# EasyEDA Pro project haptic_knob.eprj, schematic Schematic2_3
Board Name: Final; Create Date: 2025-07-09; Page Name: mcu; Project Name: haptic_knob; Schematic Name: Schematic2_3; Update Date: 2026-03-03; Company: EasyEDA.com; Page Size: A4; Version: V1.0
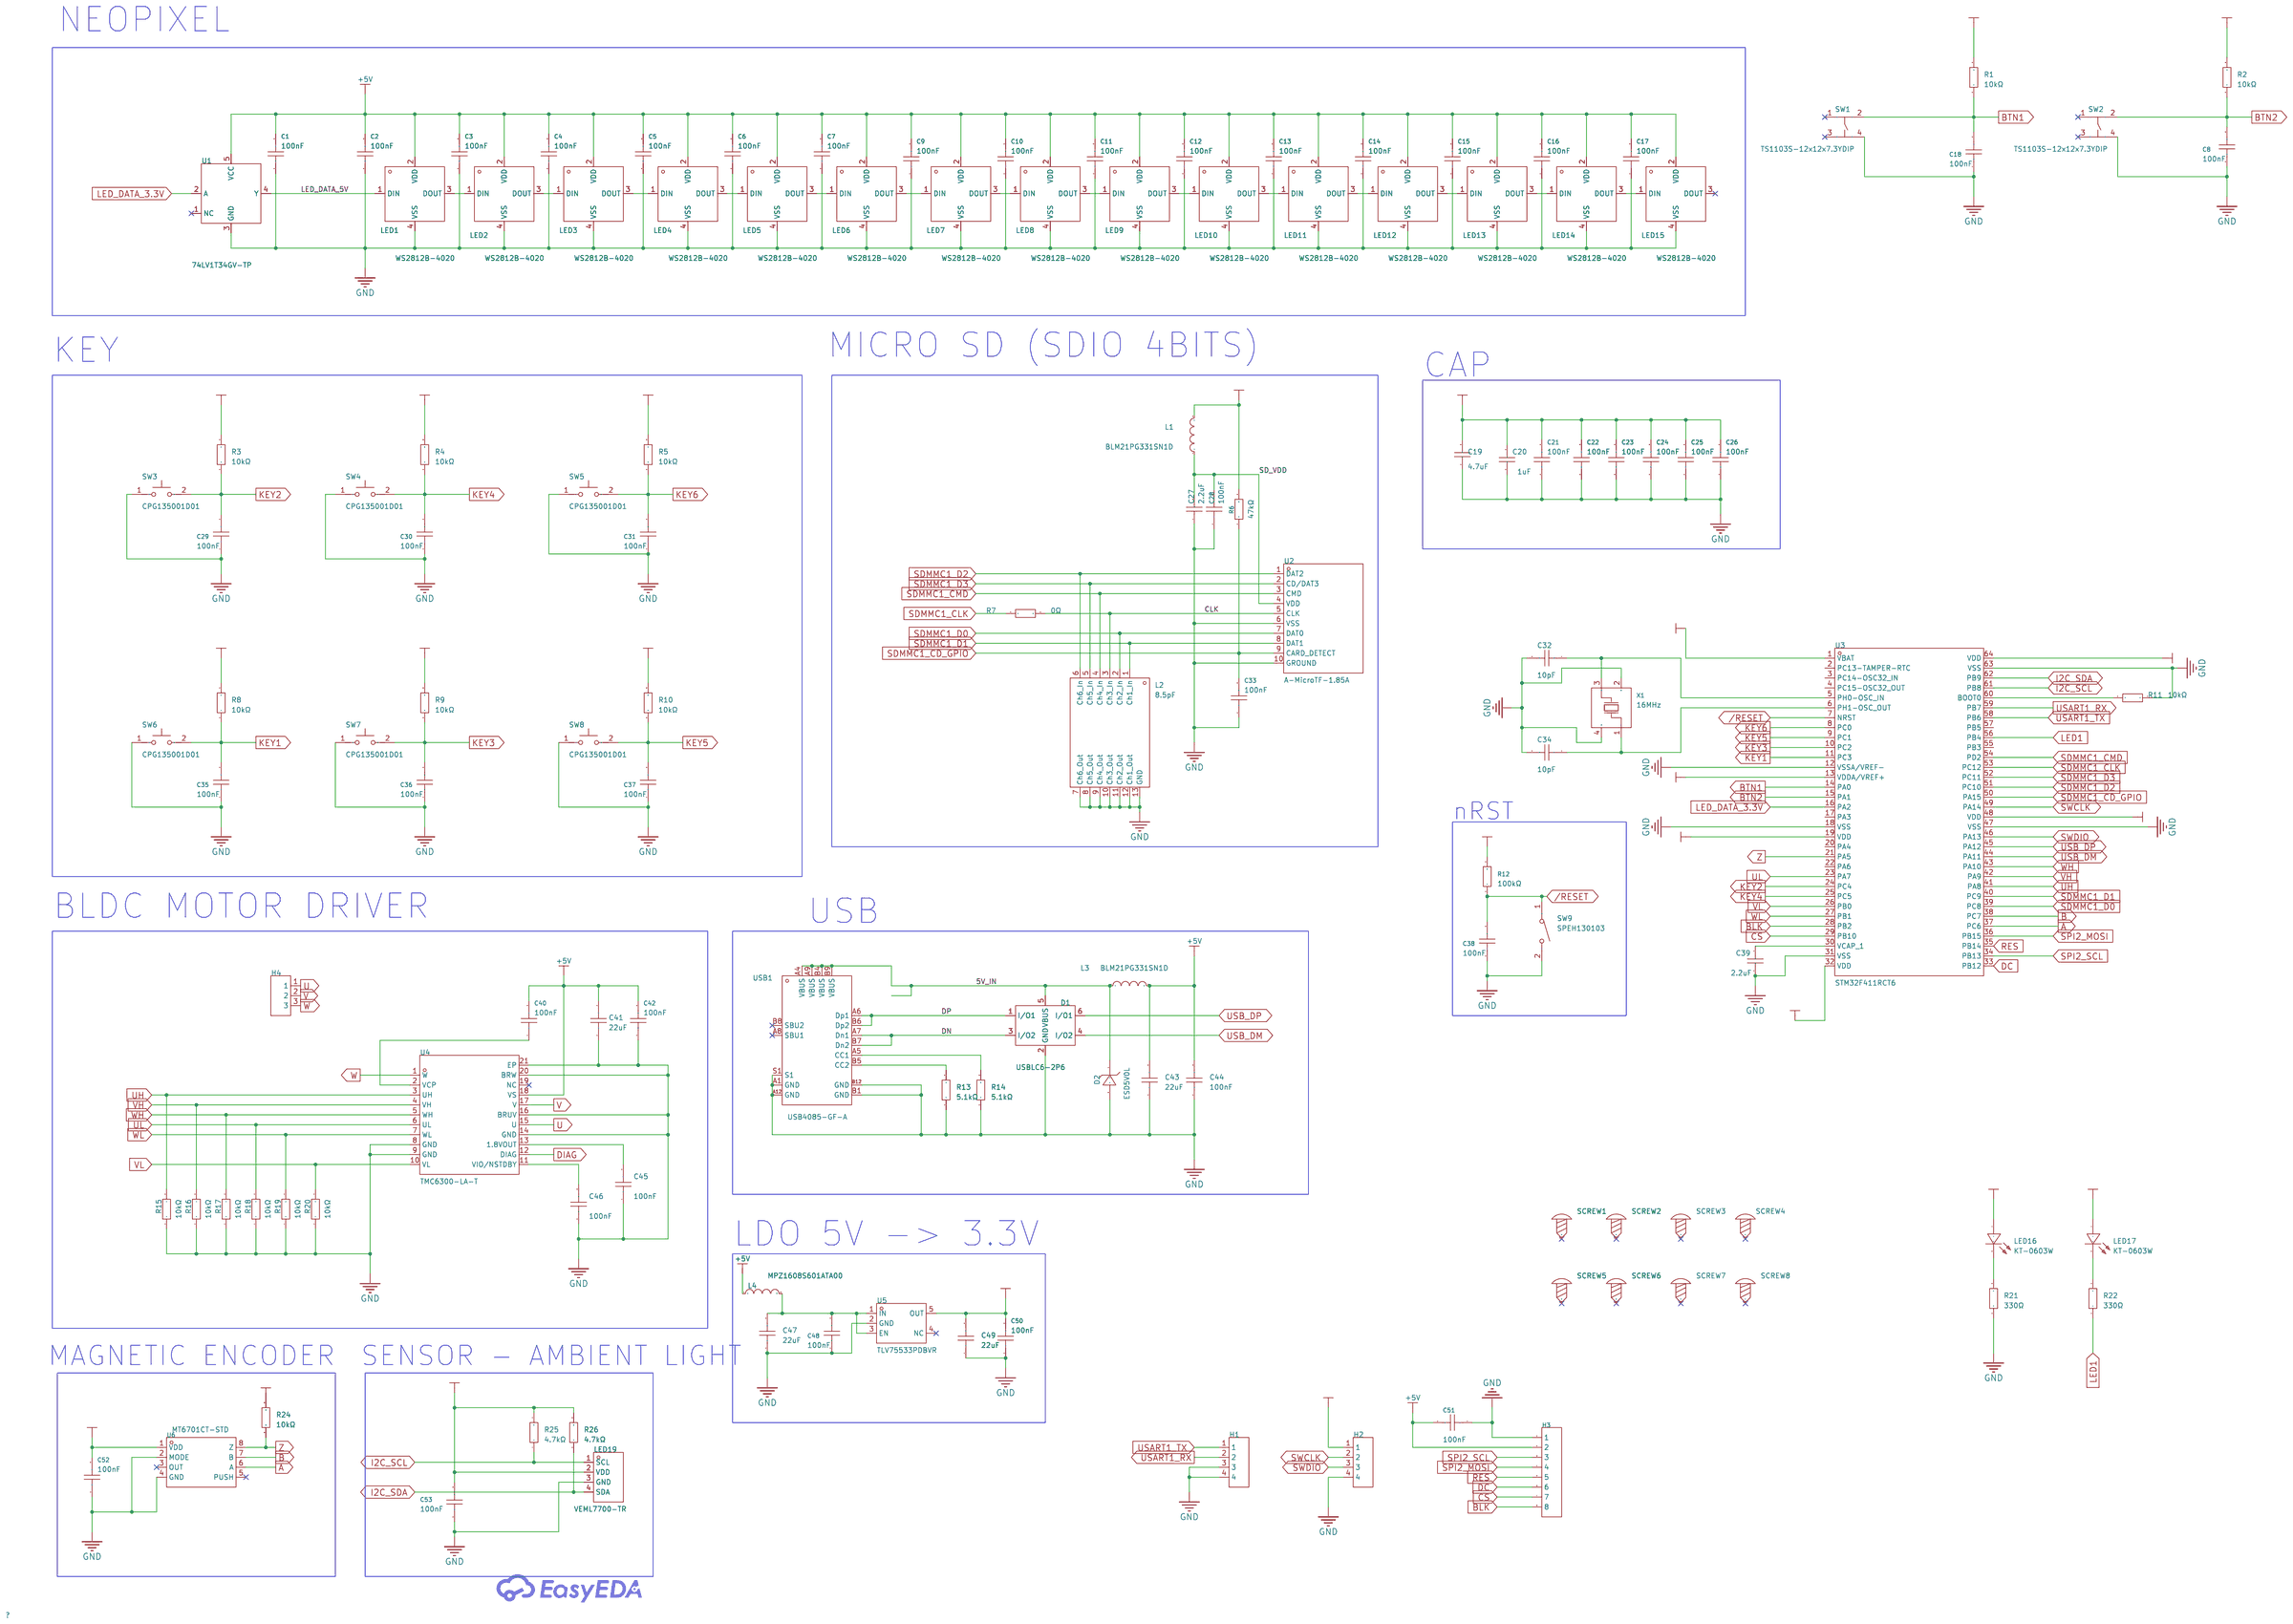
[diagram p0: schematic sheet]

## Parts
C1  100nF  [C0603]
C2  100nF  [C0603]
C3  100nF  [C0603]
C4  100nF  [C0603]
C5  100nF  [C0603]
C6  100nF  [C0603]
C7  100nF  [C0603]
C8  100nF  [C0603]
C9  100nF  [C0603]
C10  100nF  [C0603]
C11  100nF  [C0603]
C12  100nF  [C0603]
C13  100nF  [C0603]
C14  100nF  [C0603]
C15  100nF  [C0603]
C16  100nF  [C0603]
C17  100nF  [C0603]
C18  100nF  [C0603]
C19  4.7uF  [C0603]
C20  1uF  [C0603]
C21  100nF  [C0603]
C22  100nF  [C0603]
C23  100nF  [C0603]
C24  100nF  [C0603]
C25  100nF  [C0603]
C26  100nF  [C0603]
C27  2.2uF  [C0603]
C28  100nF  [C0603]
C29  100nF  [C0603]
C30  100nF  [C0603]
C31  100nF  [C0603]
C32  10pF  [C0402]
C33  100nF  [C0603]
C34  10pF  [C0402]
C35  100nF  [C0603]
C36  100nF  [C0603]
C37  100nF  [C0603]
C38  100nF  [C0603]
C39  2.2uF  [C0603]
C40  100nF  [C0805]
C41  22uF  [C0805]
C42  100nF  [C0805]
C43  22uF  [C0805]
C44  100nF  [C0603]
C45  100nF  [C0603]
C46  100nF  [C0603]
C47  22uF  [C0805]
C48  100nF  [C0603]
C49  22uF  [C0805]
C50  100nF  [C0603]
C51  100nF  [C0603]
C52  100nF  [C0603]
C53  100nF  [C0603]
D1  USBLC6-2P6  [SOT-563_L1.6-W1.2-P0.50-LS1.6-BL]
D2  ESD5V0L  [DFN1006-2L_L1.0-W0.6-P0.65-RD]
H1  -  [HDR-TH_4P-P2.54-V-M]
H2  -  [HDR-TH_4P-P2.54-V-M]
H3  -  [HDR-TH_8P-P2.54-V-F-1]
H4  -  [HDR-TH_3P-P2.54-V-M]  (no BOM)
L1  BLM21PG331SN1D  [L0805]
L2  8.5pF  [DFN-12_L2.5-W1.4-P0.40-BL-EP]  (no BOM)
L3  BLM21PG331SN1D  [L0805]
L4  MPZ1608S601ATA00  [L0603]
LED1  WS2812B-4020  [LED-SMD_WS2812B-4020]
LED2  WS2812B-4020  [LED-SMD_WS2812B-4020]
LED3  WS2812B-4020  [LED-SMD_WS2812B-4020]
LED4  WS2812B-4020  [LED-SMD_WS2812B-4020]
LED5  WS2812B-4020  [LED-SMD_WS2812B-4020]
LED6  WS2812B-4020  [LED-SMD_WS2812B-4020]
LED7  WS2812B-4020  [LED-SMD_WS2812B-4020]
LED8  WS2812B-4020  [LED-SMD_WS2812B-4020]
LED9  WS2812B-4020  [LED-SMD_WS2812B-4020]
LED10  WS2812B-4020  [LED-SMD_WS2812B-4020]
LED11  WS2812B-4020  [LED-SMD_WS2812B-4020]
LED12  WS2812B-4020  [LED-SMD_WS2812B-4020]
LED13  WS2812B-4020  [LED-SMD_WS2812B-4020]
LED14  WS2812B-4020  [LED-SMD_WS2812B-4020]
LED15  WS2812B-4020  [LED-SMD_WS2812B-4020]
LED16  KT-0603W  [LED0603-R-RD_WHITE]
LED17  KT-0603W  [LED0603-R-RD_WHITE]
LED19  VEML7700-TR  [LED-SMD_4P-L6.8-W2.4_VEML7700-TR]
R1  10kΩ  [R0603]
R2  10kΩ  [R0603]
R3  10kΩ  [R0603]
R4  10kΩ  [R0603]
R5  10kΩ  [R0603]
R6  47kΩ  [R0603]
R7  0Ω  [R0603]
R8  10kΩ  [R0603]
R9  10kΩ  [R0603]
R10  10kΩ  [R0603]
R11  10kΩ  [R0603]
R12  100kΩ  [R0603]
R13  5.1kΩ  [R0603]
R14  5.1kΩ  [R0603]
R15  10kΩ  [R0603]
R16  10kΩ  [R0603]
R17  10kΩ  [R0603]
R18  10kΩ  [R0603]
R19  10kΩ  [R0603]
R20  10kΩ  [R0603]
R21  330Ω  [R0603]
R22  330Ω  [R0603]
R24  10kΩ  [R0603]
R25  4.7kΩ  [R0603]
R26  4.7kΩ  [R0603]
SCREW1  -  [Screw-Hole-M2]
SCREW2  -  [Screw-Hole-M2]
SCREW3  -  [Screw-Hole-M2]
SCREW4  -  [Screw-Hole-M2]
SCREW5  -  [Screw-Hole-M3]
SCREW6  -  [Screw-Hole-M3]
SCREW7  -  [Screw-Hole-M3]
SCREW8  -  [Screw-Hole-M3]
SW1  TS1103S-12x12x7.3YDIP  [SW-TH_4P-L12.0-W12.0-P5.00-LS12.5-TL]
SW2  TS1103S-12x12x7.3YDIP  [SW-TH_4P-L12.0-W12.0-P5.00-LS12.5-TL]
SW3  CPG135001D01  [KEY-TH_CPG135001D0X]
SW4  CPG135001D01  [KEY-TH_CPG135001D0X]
SW5  CPG135001D01  [KEY-TH_CPG135001D0X]
SW6  CPG135001D01  [KEY-TH_CPG135001D0X]
SW7  CPG135001D01  [KEY-TH_CPG135001D0X]
SW8  CPG135001D01  [KEY-TH_CPG135001D0X]
SW9  SPEH130103  [SW-SMD_L6.0-W6.0-LS6.6]
U1  74LV1T34GV-TP  [SOT-23-5_L3.0-W1.7-P0.95-LS2.8-BL]
U2  A-MicroTF-1.85A  [TF-SMD_A-MICROTF-1.85A]
U3  STM32F411RCT6  [LQFP-64_L10.0-W10.0-P0.50-LS12.0-BL]
U4  TMC6300-LA-T  [QFN-20_L3.0-W3.0-P0.40-BL-EP1.7]
U5  TLV75533PDBVR  [SOT-23-5_L3.0-W1.7-P0.95-LS2.8-BR]
U6  MT6701CT-STD  [SOP-8_L4.9-W3.9-P1.27-LS6.0-BL]
USB1  USB4085-GF-A  [USC-C-SMD_USB4085-GF-A]
X1  16MHz  [CRYSTAL-SMD_4P-L2.5-W2.0-BL-A]

## Library data of the parts
C1-C18 C21-C26 C28-C31 C33 C35-C38 C48 C50-C53 = CC0603KRX7R9BB104: Capacitance: Tolerance:±10% Tolerance:±10% Voltage Rated: Temperature Coefficient:; LCSC Part Name: 100nF ±10% 50V; Supplier Part: C14663; Manufacturer: YAGEO(国巨); Supplier Footprint: 0603; JLCPCB Part Class: Basic Part; Datasheet: https://atta.szlcsc.com/upload/public/pdf/source/20180910/C282072_33301C7F631E79921B82A8DAC6BCC5B3.pdf; Supplier: LCSC; Tolerance: ±10%
C19 = CL10A475KO8NNNC: Capacitance: Tolerance:±10% Tolerance:±10% Voltage Rated: Temperature Coefficient:; LCSC Part Name: 4.7uF ±10% 16V; Supplier Part: C19666; Manufacturer: SAMSUNG(三星); Supplier Footprint: 0603; JLCPCB Part Class: Basic Part; Datasheet: https://atta.szlcsc.com/upload/public/pdf/source/20160218/1457707763339.pdf; Supplier: LCSC; Tolerance: ±10%
C20 = CL10A105KA8NNNC: LCSC Part Name: 1uF ±10% 25V; Supplier Part: C5673; Manufacturer: SAMSUNG(三星); Supplier Footprint: 0603; JLCPCB Part Class: Extended Part; Datasheet: https://item.szlcsc.com/datasheet/CL10A105KA8NNNC/6132.html; Supplier: LCSC; Tolerance: ±10%; Voltage Rating: 25V; Temperature Coefficient: X5R
C27 C39 = CL10A225KO8NNNC: Capacitance: Tolerance:±10% Tolerance:±10% Voltage Rated: Temperature Coefficient:; LCSC Part Name: 2.2uF ±10% 16V; Supplier Part: C23630; Manufacturer: SAMSUNG(三星); Supplier Footprint: 0603; JLCPCB Part Class: Basic Part; Datasheet: https://atta.szlcsc.com/upload/public/pdf/source/20160218/1457707763339.pdf; Supplier: LCSC; Tolerance: ±10%
C32 C34 = CL05C100JB5NNNC: Capacitance: Tolerance:±5% Tolerance:±5% Voltage Rated: Temperature Coefficient:; LCSC Part Name: 10pF ±5% 50V; Supplier Part: C32949; Manufacturer: SAMSUNG(三星); Supplier Footprint: 0402; JLCPCB Part Class: Basic Part; Datasheet: https://atta.szlcsc.com/upload/public/pdf/source/20160218/1457707763339.pdf; Supplier: LCSC; Tolerance: ±5%
C40 C42 = CL21B104KBCNNNC: Capacitance:100nF Tolerance:±10% Tolerance:±10% Voltage Rating:50V Temperature Coefficient:X7R; LCSC Part Name: 100nF ±10% 50V; Supplier Part: C1711; Manufacturer: SAMSUNG(三星); Supplier Footprint: 0805; JLCPCB Part Class: Extended Part; Datasheet: https://item.szlcsc.com/datasheet/CL21B104KBCNNNC/2063.html; Supplier: LCSC; Tolerance: ±10%; Voltage Rating: 50V; Temperature Coefficient: X7R
C41 C43 C47 C49 = CL21A226MAQNNNE: Capacitance: Tolerance:±20% Tolerance:±20% Voltage Rated: Temperature Coefficient:; LCSC Part Name: 22uF ±20% 25V; Supplier Part: C45783; Manufacturer: SAMSUNG(三星); Supplier Footprint: 0805; JLCPCB Part Class: Basic Part; Datasheet: https://atta.szlcsc.com/upload/public/pdf/source/20160218/1457707763339.pdf; Supplier: LCSC; Tolerance: ±20%
C44-C46 = TCC0603X7R104K160CT: LCSC Part Name: 100nF ±10% 16V; Supplier Part: C20539422; Manufacturer: CCTC(三环); Supplier Footprint: 0603; JLCPCB Part Class: Extended Part; Datasheet: https://item.szlcsc.com/datasheet/TCC0603X7R104K160CT/21878090.html; Supplier: LCSC; Tolerance: ±10%; Voltage Rating: 16V; Temperature Coefficient: X7R
D1 = USBLC6-2P6_C49451919: Polarity:Unidirectional Reverse Stand-Off Voltage (Vrwm):5V Clamping Voltage:14V Peak Pulse Current (Ipp):5.5A Peak Pulse Power Dissipation (Ppp):80W Voltage - Breakdown:6V Reverse Leakage Current (Ir):80nA Number of Channels:2 Operating Temperature:-55℃~; LCSC Part Name: 单向 5V 5.5A; Supplier Part: C49451919; Manufacturer: R+O(宏嘉诚); Supplier Footprint: SOT-563; JLCPCB Part Class: Extended Part; Datasheet: https://item.szlcsc.com/datasheet/USBLC6-2P6/51998875.html; Supplier: LCSC; Polarity: Unidirectional; Reverse Stand-Off Voltage (Vrwm): 5V; Clamping Voltage: 14V; Peak Pulse Current (Ipp): 5.5A; Peak Pulse Power Dissipation (Ppp): 80W; Voltage - Breakdown: 6V; Reverse Leakage Current (Ir): 80nA; Number of Channels: 2; Operating Temperature: -55℃~+150℃; Type: ESD; Junction Capacitance: 0.5pF
D2 = ESD5V0L: LCSC Part Name: 单向TVS 5V截止 峰值浪涌电流：9A@8/20us; Supplier Part: C20600744; Manufacturer: YANGJIE(扬杰); Supplier Footprint: DFN1006-2L; JLCPCB Part Class: Extended Part; Datasheet: https://item.szlcsc.com/datasheet/ESD5V0L/21941472.html; Supplier: LCSC; Polarity: Unidirectional; Reverse Stand-Off Voltage (Vrwm): 5V; Clamping Voltage: 12V; Peak Pulse Current (Ipp): 9A@8/20us; Peak Pulse Power Dissipation (Ppp): 108W@8/20us; Voltage - Breakdown: 8V; Reverse Leakage Current (Ir): 100nA; Number of Channels: 1; level of protection: IEC 61000-4-5；IEC 61000-4-2; Type: TVS; Junction Capacitance: 52pF
H1 H2 = HDR-M_2.54_1x4P: Supplier Footprint: Through
H3 = HDR-F_2.54_1x8P: Supplier Footprint: Through
H4 = HDR-M_2.54_1x3P: Supplier Footprint: Through
L1 L3 = BLM21PG331SN1D: LCSC Part Name: 单路 0805磁珠 阻抗330Ω@100MHz; Supplier Part: C74764; Manufacturer: muRata(村田); Supplier Footprint: 0805; JLCPCB Part Class: Extended Part; Datasheet: https://item.szlcsc.com/datasheet/BLM21PG331SN1D/75886.html; Supplier: LCSC; Impedance @ Frequency: 330Ω@100MHz; Tolerance: ±25%; DC Resistance(DCR): 70mΩ; Current Rating: 1.5A; Number of Circuits: 1
L2 = TPD6F003DQDR: LCSC Part Name: 两路6阶 具有ESD保护的EMI滤波器; Supplier Part: C2863873; Manufacturer: TI(德州仪器); Supplier Footprint: WSON-12-EP(1.4x2.5); JLCPCB Part Class: Extended Part; Datasheet: https://www.ti.com/cn/lit/gpn/tpd6f003; Supplier: LCSC; Frequency - Cutoff or Center: 200MHz; Filter Order: 6; ESD Protection: Yes; Number of Channels: 2; Attenuation Value: 25dB@1GHz; Operating Temperature: -40℃~+85℃
L4 = MPZ1608S601ATA00: LCSC Part Name: 单路 0603磁珠 阻抗600Ω@100MHz; Supplier Part: C107335; Manufacturer: TDK; Supplier Footprint: 0603; JLCPCB Part Class: Extended Part; Datasheet: https://item.szlcsc.com/datasheet/MPZ1608S601ATA00/108554.html; Supplier: LCSC; Impedance @ Frequency: 600Ω@100MHz; Tolerance: ±25%; DC Resistance(DCR): 150mΩ; Current Rating: 1A; Number of Circuits: 1; Operating Temperature: -55℃~+125℃
LED1-LED15 = WS2812B-4020: Wavelength:620nm~625nm；515nm~525nm；465nm~475nm; LCSC Part Name: RGB三色; Supplier Part: C965557; Manufacturer: worldsemi; Supplier Footprint: SMD,4x2mm; JLCPCB Part Class: Extended Part; Datasheet: https://item.szlcsc.com/datasheet/WS2812B-4020/1051117.html; Supplier: LCSC; Wavelength: 620nm~625nm；515nm~525nm；465nm~475nm
LED16 LED17 = KT-0603W: Emitted Color:White; LCSC Part Name: 0603 白灯 高亮; Supplier Part: C2290; Manufacturer: KENTO; Supplier Footprint: 0603; JLCPCB Part Class: Basic Part; Datasheet: https://atta.szlcsc.com/upload/public/pdf/source/20221101/4C23D5C85BA051E44A00B833D0A41468.pdf; Supplier: LCSC; Emitted Color: White
LED19 = VEML7700-TR: LCSC Part Name: I2C接口的高精度环境光传感器; Supplier Part: C504893; Manufacturer: VISHAY(威世); Supplier Footprint: SMD-4P; JLCPCB Part Class: Extended Part; Datasheet: https://item.szlcsc.com/datasheet/VEML7700-TR/519982.html; Supplier: LCSC; Measurement Type: Light Intensity; Photoperceptivity: 120klx; Interface: I2C; Resolution(Bits): 16bit; Voltage - Supply: 2.5V~3.6V; Operating Temperature: -25℃~+85℃; Length: 6.8mm; Width: 2.35mm; Height: 3mm
R1-R5 R8-R11 R15-R20 R24 = RC0603FR-0710KL: Type:Thick Film Resistors Resistance: Tolerance:±1% Tolerance:±1% Power(Watts): Overload Voltage (Max): Temperature Coefficient:±100ppm/℃ Temperature Coefficient:±100ppm/℃ Operating Temperature Range:-55℃~+155℃ Operating Temperature Range:-55℃~+155℃; LCSC Part Name: 厚膜电阻 10kΩ ±1% 100mW; Supplier Part: C98220; Manufacturer: YAGEO(国巨); Supplier Footprint: 0603; JLCPCB Part Class: Extended Part; Datasheet: https://atta.szlcsc.com/upload/public/pdf/source/20180927/C295883_E8D83085EA81BD7DE0B2B681138C15EE.pdf; Supplier: LCSC; Type: Thick Film Resistors; Tolerance: ±1%; Temperature Coefficient: ±100ppm/℃; Operating Temperature Range: -55℃~+155℃
R6 = 0603WAJ0473T5E: LCSC Part Name: 47kΩ ±5% 100mW 厚膜电阻; Supplier Part: C25600; Manufacturer: UNI-ROYAL(厚声); Supplier Footprint: 0603; JLCPCB Part Class: Extended Part; Datasheet: https://item.szlcsc.com/datasheet/0603WAJ0473T5E/26343.html; Supplier: LCSC; Type: Thick Film Resistor; Tolerance: ±5%; Power(Watts): 100mW; Voltage-Supply(Max): 75V; Temperature Coefficient: ±100ppm/℃; Operating Temperature: -55℃~+155℃
R7 = RC0603FR-070RL: LCSC Part Name: 厚膜电阻 0Ω ±1% 100mW; Supplier Part: C100044; Manufacturer: YAGEO(国巨); Supplier Footprint: 0603; JLCPCB Part Class: Extended Part; Datasheet: https://item.szlcsc.com/datasheet/RC0603FR-070RL/101258.html; Supplier: LCSC; Type: Thick Film Resistors; Tolerance: ±1%; Power(Watts): 100mW; Voltage-Supply(Max): 75V; Operating Temperature: -55℃~+155℃
R12 = RC0603FR-07100KL: Type:Thick Film Resistors Resistance: Tolerance:±1% Tolerance:±1% Power(Watts): Overload Voltage (Max): Temperature Coefficient:±100ppm/℃ Temperature Coefficient:±100ppm/℃ Operating Temperature Range:-55℃~+155℃ Operating Temperature Range:-55℃~+155℃; LCSC Part Name: 厚膜电阻 100kΩ ±1% 100mW; Supplier Part: C14675; Manufacturer: YAGEO(国巨); Supplier Footprint: 0603; JLCPCB Part Class: Extended Part; Datasheet: https://atta.szlcsc.com/upload/public/pdf/source/20140324/1457707028752.pdf; Supplier: LCSC; Type: Thick Film Resistors; Tolerance: ±1%; Temperature Coefficient: ±100ppm/℃; Operating Temperature Range: -55℃~+155℃
R13 = 0603WAF5101T5E: Type:Thick Film Resistor Resistance:5.1kΩ Tolerance:±1% Tolerance:±1% Power(Watts):100mW Voltage-Supply(Max):75V Temperature Coefficient:±100ppm/℃ Temperature Coefficient:±100ppm/℃ Operating Temperature:-55℃~+155℃ Operating Temperature:-55℃~+155℃; LCSC Part Name: 5.1kΩ ±1% 100mW 厚膜电阻; Supplier Part: C23186; Manufacturer: UNI-ROYAL(厚声); Supplier Footprint: 0603; JLCPCB Part Class: Basic Part; Datasheet: https://item.szlcsc.com/datasheet/0603WAF5101T5E/23913.html; Supplier: LCSC; Type: Thick Film Resistor; Tolerance: ±1%; Power(Watts): 100mW; Temperature Coefficient: ±100ppm/℃; Operating Temperature Range: -55℃~+155℃; Voltage-Supply(Max): 75V; Operating Temperature: -55℃~+155℃
R14 = 0603WAF5101T5E: Type:Thick Film Resistor Resistance:5.1kΩ Tolerance:±1% Tolerance:±1% Power(Watts):100mW Voltage-Supply(Max):75V Temperature Coefficient:±100ppm/℃ Temperature Coefficient:±100ppm/℃ Operating Temperature:-55℃~+155℃ Operating Temperature:-55℃~+155℃; LCSC Part Name: 5.1kΩ ±1% 100mW 厚膜电阻; Supplier Part: C23186; Manufacturer: UNI-ROYAL(厚声); Supplier Footprint: 0603; JLCPCB Part Class: Basic Part; Datasheet: https://atta.szlcsc.com/upload/public/pdf/source/20200306/C422600_1E6D84923E4A46A82E41ADD87F860B5C.pdf; Supplier: LCSC; Type: Thick Film Resistors; Tolerance: ±1%; Power(Watts): 100mW; Temperature Coefficient: ±100ppm/℃; Operating Temperature Range: -55℃~+155℃; Voltage-Supply(Max): 75V; Operating Temperature: -55℃~+155℃
R21 R22 = 0603WAF3300T5E: Type:Thick Film Resistors Resistance: Tolerance:±1% Tolerance:±1% Power(Watts): Overload Voltage (Max): Temperature Coefficient:±100ppm/℃ Temperature Coefficient:±100ppm/℃ Operating Temperature Range:-55℃~+155℃ Operating Temperature Range:-55℃~+155℃; LCSC Part Name: 330Ω ±1% 100mW 厚膜电阻; Supplier Part: C23138; Manufacturer: UNI-ROYAL(厚声); Supplier Footprint: 0603; JLCPCB Part Class: Basic Part; Datasheet: https://atta.szlcsc.com/upload/public/pdf/source/20200306/C422600_1E6D84923E4A46A82E41ADD87F860B5C.pdf; Supplier: LCSC; Type: Thick Film Resistors; Tolerance: ±1%; Temperature Coefficient: ±100ppm/℃; Operating Temperature Range: -55℃~+155℃
R25 R26 = 0603WAF4701T5E: LCSC Part Name: 4.7kΩ ±1% 100mW 厚膜电阻; Supplier Part: C23162; Manufacturer: UNI-ROYAL(厚声); Supplier Footprint: 0603; JLCPCB Part Class: Basic Part; Datasheet: https://item.szlcsc.com/datasheet/0603WAF4701T5E/23889.html; Supplier: LCSC; Type: Thick Film Resistor; Tolerance: ±1%; Power(Watts): 100mW; Voltage-Supply(Max): 75V; Temperature Coefficient: ±100ppm/℃; Operating Temperature: -55℃~+155℃
SCREW1-SCREW4 = Screw-Hole-M2: Supplier Footprint: 插件
SCREW5-SCREW8 = Screw-Hole-M3: Supplier Footprint: 插件
SW1 SW2 = TS1103S-12x12x7.3YDIP: Supplier Part: C48677980; Manufacturer: CAX(创都); Supplier Footprint: 插件-4P,12x12mm; JLCPCB Part Class: Extended Part; Datasheet: https://item.szlcsc.com/datasheet/TS1103S-12x12x7.3YDIP/50959181.html; Supplier: LCSC
SW3-SW8 = CPG135001D01: LCSC Part Name: CHOC 红轴; Supplier Part: C400229; Manufacturer: Kailh(凯华); Supplier Footprint: 插件; JLCPCB Part Class: Extended Part; Datasheet: https://item.szlcsc.com/datasheet/CPG135001D01/383994.html; Supplier: LCSC; Axis Type: Red Switch; Number of Pins: 2; Life: 70,000,000 Cycles; Operation Force: 50gf@±10gf; Conduction Travel: 1.5mm; Operating Temperature: -20℃~+80℃
SW9 = SPEH130103: Self Lock / No Lock:- Actuator Style:Square Plunger IP Rating:- Mounting Style:Brick nogging Contact Current:50mA Voltage Rating (AC):- Voltage Rating (DC):16V Actuator/Cap Color:Black With Lamp:- Pin Style:J pin Operating Force:3N Operating Temperature:-; Supplier Part: C390925; Manufacturer: ALPSALPINE(阿尔卑斯阿尔派); Supplier Footprint: SMD,6x6mm; JLCPCB Part Class: Extended Part; Datasheet: https://atta.szlcsc.com/upload/public/pdf/source/20190509/C390925_9E40F954D7E8486AE6D5C4A7777F11F7.pdf; Supplier: LCSC; Actuator Style: Square Plunger; Mounting Style: Brick nogging; Contact Current: 50mA; Voltage Rating (DC): 16V; Actuator/Cap Color: Black; Pin Style: J pin; Operating Force: 3N; Operating Temperature: -40℃~+90℃
U1 = 74LV1T34GV-TP: Supplier Part: C52098009; Manufacturer: TECH PUBLIC(台舟); Supplier Footprint: SOT-23-5; JLCPCB Part Class: Extended Part; Datasheet: https://item.szlcsc.com/datasheet/74LV1T34GV-TP/54871681.html; Supplier: LCSC
U2 = A-MicroTF-1.85A: LCSC Part Name: 自弹式 MicroSD卡(TF卡) 卡座; Supplier Part: C22467599; Manufacturer: MyAntenna(摩天射频); Supplier Footprint: SMD; JLCPCB Part Class: Extended Part; Datasheet: https://item.szlcsc.com/datasheet/A-MicroTF-1.85A/24170456.html; Supplier: LCSC; Card Connection Mode: Push-Push; Card Type: MicroSD Card (TF Card); Connector Type: Connector and Ejector; Height Above Board: 1.85mm; Operating Temperature: -25℃~+85℃
U3 = STM32F411RCT6: LCSC Part Name: 带DSP和FPU的高性能基本型系列ARM Cortex-M4 MCU，具有256 KB Flash、100 MHz CPU和ART加速器; Supplier Part: C222222; Manufacturer: ST(意法半导体); Supplier Footprint: LQFP-64(10x10); JLCPCB Part Class: Extended Part; Datasheet: https://item.szlcsc.com/datasheet/STM32F411RCT6/222603.html; Supplier: LCSC; CPU Core: ARM-M4; CPU Maximum Speed: 100MHz; Program Storage Size: 256KB; Program Memory Type: FLASH; Number of I/O: 50; ADC (Bit): 12bit; Voltage - Supply: 1.7V~3.6V
U4 = TMC6300-LA-T_C5274455: LCSC Part Name: 用于三相无刷直流（BLDC）/永磁同步电机（PMSM）的高效低压、零待机电流驱动器; Supplier Part: C5274455; Manufacturer: TRINAMIC; Supplier Footprint: QFN-20(3x3); JLCPCB Part Class: Extended Part; Datasheet: https://item.szlcsc.com/datasheet/TMC6300-LA-T/6005328.html; Supplier: LCSC; Drive Type: Three Phase; Integrated FETs: Yes; Number of Half Bridges: 3; Output Current: 2A; Peak Current: 2A; Voltage - Supply: 2V~11V; Quiescent Current(Iq): 50nA; Operating Temperature: -40℃~+125℃
U5 = TLV75533PDBVR: LCSC Part Name: 3.3V 500mA 5.5V; Supplier Part: C404027; Manufacturer: TI(德州仪器); Supplier Footprint: SOT-23-5; JLCPCB Part Class: Extended Part; Datasheet: https://www.ti.com/cn/lit/gpn/tlv755p; Supplier: LCSC; Output Type: Fixed; Voltage - Supply: 5.5V; Output Voltage: 3.3V; Output Current: 500mA; Power Supply Rejection Ratio (PSRR): 46dB@(100kHz); Voltage Dropout: 238mV@(500mA); standby current: 25uA; Noise: 71.5uVrms; Features: Under Voltage Lockout；Soft Start；Over Temperature Protection；Over Current Protection; Operating Temperature: -40℃~+125℃@(Tj); Output Configuration: Positive; Number of Outputs: 1
U6 = MT6701CT-STD: LCSC Part Name: 霍尔在线编程角度位置传感器; Supplier Part: C2856764; Manufacturer: MagnTek(麦歌恩); Supplier Footprint: SOP-8; JLCPCB Part Class: Extended Part; Datasheet: https://item.szlcsc.com/datasheet/MT6701CT-STD/3056853.html; Supplier: LCSC
USB1 = USB4085-GF-A_C7095263: Connector Type:Type-C Protocol Standard:USB 2.0 Gender:Female Mounting Type:Right Angle Number of Ports:1 Current Rating-Power:5A Voltage Rating:48V Detection color:Black Operating Temperature:-40℃~+85℃ Operating Temperature:-40℃~+85℃; LCSC Part Name: Type-C 母 弯插; Supplier Part: C7095263; Manufacturer: GCT; Supplier Footprint: 插件; JLCPCB Part Class: Extended Part; Datasheet: https://item.szlcsc.com/datasheet/USB4085-GF-A/8061907.html; Supplier: LCSC; Connector Type: Type-C; Protocol Standard: USB 2.0; Gender: Female; Mounting Type: Right Angle; Number of Ports: 1; Current Rating-Power: 5A; Voltage Rating: 48V; Detection color: Black; Operating Temperature: -40℃~+85℃
X1 = NX2520SA-16MHZ-STD-CSW-5: LCSC Part Name: 16MHz ±15ppm 8pF; Supplier Part: C280836; Manufacturer: NDK; Supplier Footprint: SMD2520-4P; JLCPCB Part Class: Extended Part; Datasheet: https://item.szlcsc.com/datasheet/NX2520SA-16MHZ-STD-CSW-5/267716.html; Supplier: LCSC; Normal temperature Frequency Tolerance: ±15ppm; Load Capacitance: 8pF; Frequency Stability: ±25ppm; Equivalent Series Resistance(ESR): 80Ω; Operating Temperature: -40℃~+85℃

## Nets
3.3V: C19.2 C20.2 C21.2 C22.2 C23.2 C24.2 C25.2 C26.2 C49.2 C50.2 C52.2 C53.2 H2.1 L1.2 LED16.1(A) LED17.1(A) LED19.2(VDD) R1.2 R2.2 R3.2 R4.2 R5.2 R6.2 R8.2 R9.2 R10.2 R12.2 R24.2 R25.2 R26.2 U3.1(VBAT) U3.13(VDDA/VREF+) U3.19(VDD) U3.32(VDD) U3.48(VDD) U3.64(VDD) U5.5(OUT) U6.1(VDD)
5V_IN: D1.5(VBUS) D2.1(C) L3.1 USB1.A4(VBUS) USB1.A9(VBUS) USB1.B4(VBUS) USB1.B9(VBUS)
+5V: C1.2 C2.2 C3.2 C4.2 C5.2 C6.2 C7.2 C9.2 C10.2 C11.2 C12.2 C13.2 C14.2 C15.2 C16.2 C17.2 C40.2 C41.2 C42.2 C43.2 C44.2 C51.2 H3.2 L3.2 L4.1 LED1.2(VDD) LED2.2(VDD) LED3.2(VDD) LED4.2(VDD) LED5.2(VDD) LED6.2(VDD) LED7.2(VDD) LED8.2(VDD) LED9.2(VDD) LED10.2(VDD) LED11.2(VDD) LED12.2(VDD) LED13.2(VDD) LED14.2(VDD) LED15.2(VDD) U1.5(VCC) U4.18(VS)
GND: C1.1 C2.1 C3.1 C4.1 C5.1 C6.1 C7.1 C8.1 C9.1 C10.1 C11.1 C12.1 C13.1 C14.1 C15.1 C16.1 C17.1 C18.1 C19.1 C20.1 C21.1 C22.1 C23.1 C24.1 C25.1 C26.1 C27.1 C28.1 C29.1 C30.1 C31.1 C32.2 C33.1 C34.2 C35.1 C36.1 C37.1 C38.1 C39.1 C41.1 C42.1 C43.1 C44.1 C45.1 C46.1 C47.1 C48.1 C49.1 C50.1 C51.1 C52.1 C53.1 D1.2(GND) D2.2(A) H1.3 H1.4 H2.4 H3.1 L2.7(Ch6_Out) L2.8(Ch5_Out) L2.9(Ch4_Out) L2.10(Ch3_Out) L2.11(Ch2_Out) L2.12(Ch1_Out) L2.13(GND) LED1.4(VSS) LED2.4(VSS) LED3.4(VSS) LED4.4(VSS) LED5.4(VSS) LED6.4(VSS) LED7.4(VSS) LED8.4(VSS) LED9.4(VSS) LED10.4(VSS) LED11.4(VSS) LED12.4(VSS) LED13.4(VSS) LED14.4(VSS) LED15.4(VSS) LED19.3(GND) R11.1 R13.1 R14.1 R15.1 R16.1 R17.1 R18.1 R19.1 R20.1 R21.1 SW1.4 SW2.4 SW3.1 SW4.1 SW5.1 SW6.1 SW7.1 SW8.1 SW9.2 U1.3(GND) U2.6(VSS) U2.10(GROUND) U3.12(VSSA/VREF-) U3.18(VSS) U3.31(VSS) U3.47(VSS) U3.63(VSS) U4.8(GND) U4.9(GND) U4.14(GND) U4.16(BRUV) U4.20(BRW) U4.21(EP) U5.2(GND) U6.2(MODE) U6.4(GND) USB1.A1(GND) USB1.A12(GND) USB1.B1(GND) USB1.B12(GND) USB1.S1 X1.2(GND) X1.4(GND)
/RESET: C38.2 R12.1 SW9.1 U3.7(NRST)
A: U3.37(PC6) U6.6(A)
B: U3.38(PC7) U6.7(B)
BLK: H3.8 U3.28(PB2)
BTN1: C18.2 R1.1 SW1.2 U3.14(PA0)
BTN2: C8.2 R2.1 SW2.2 U3.15(PA1)
CLK: L2.3(Ch3_In) R7.2 U2.5(CLK)
CS: H3.7 U3.29(PB10)
DC: H3.6 U3.33(PB12)
DIAG: U4.12(DIAG)
DN: D1.3(I/O2) USB1.A7(Dn1) USB1.B7(Dn2)
DP: D1.1(I/O1) USB1.A6(Dp1) USB1.B6(Dp2)
I2C_SCL: LED19.1(SCL) R25.1 U3.61(PB8)
I2C_SDA: LED19.4(SDA) R26.1 U3.62(PB9)
KEY1: C35.2 R8.1 SW6.2 U3.11(PC3)
KEY2: C29.2 R3.1 SW3.2 U3.24(PC4)
KEY3: C36.2 R9.1 SW7.2 U3.10(PC2)
KEY4: C30.2 R4.1 SW4.2 U3.25(PC5)
KEY5: C37.2 R10.1 SW8.2 U3.9(PC1)
KEY6: C31.2 R5.1 SW5.2 U3.8(PC0)
LED1: R22.1 U3.56(PB4)
LED_DATA_3.3V: U1.2(A) U3.16(PA2)
LED_DATA_5V: LED1.1(DIN) U1.4(Y)
RES: H3.5 U3.35(PB14)
SD_VDD: C27.2 C28.2 L1.1 U2.4(VDD)
SDMMC1_CD_GPIO: C33.2 R6.1 U2.9(CARD_DETECT) U3.50(PA15)
SDMMC1_CLK: R7.1 U3.53(PC12)
SDMMC1_CMD: L2.4(Ch4_In) U2.3(CMD) U3.54(PD2)
SDMMC1_D0: L2.2(Ch2_In) U2.7(DAT0) U3.39(PC8)
SDMMC1_D1: L2.1(Ch1_In) U2.8(DAT1) U3.40(PC9)
SDMMC1_D2: L2.6(Ch6_In) U2.1(DAT2) U3.51(PC10)
SDMMC1_D3: L2.5(Ch5_In) U2.2(CD/DAT3) U3.52(PC11)
SPI2_MOSI: H3.4 U3.36(PB15)
SPI2_SCL: H3.3 U3.34(PB13)
SWCLK: H2.2 U3.49(PA14)
SWDIO: H2.3 U3.46(PA13)
U: H4.1 U4.15(U)
UH: R15.2 U3.41(PA8) U4.3(UH)
UL: R18.2 U3.23(PA7) U4.6(UL)
USART1_RX: H1.2 U3.59(PB7)
USART1_TX: H1.1 U3.58(PB6)
USB_DM: D1.4(I/O2) U3.44(PA11)
USB_DP: D1.6(I/O1) U3.45(PA12)
V: H4.2 U4.17(V)
VH: R16.2 U3.42(PA9) U4.4(VH)
VL: R20.2 U3.26(PB0) U4.10(VL)
W: H4.3 U4.1(W)
WH: R17.2 U3.43(PA10) U4.5(WH)
WL: R19.2 U3.27(PB1) U4.7(WL)
Z: R24.1 U3.21(PA5) U6.8(Z)
$3N85265: R13.2 USB1.B5(CC2)
$3N85270: R14.2 USB1.A5(CC1)
$3N98862: C40.1 U4.2(VCP)
$3N98902: C45.2 U4.13(1.8VOUT)
$3N98953: C46.2 U4.11(VIO/NSTDBY)
$3N107563: LED1.3(DOUT) LED2.1(DIN)
$3N107567: LED2.3(DOUT) LED3.1(DIN)
$3N107572: LED3.3(DOUT) LED4.1(DIN)
$3N107577: LED4.3(DOUT) LED5.1(DIN)
$3N107582: LED5.3(DOUT) LED6.1(DIN)
$3N107587: LED6.3(DOUT) LED7.1(DIN)
$3N107592: LED7.3(DOUT) LED8.1(DIN)
$3N107597: LED8.3(DOUT) LED9.1(DIN)
$3N107605: LED9.3(DOUT) LED10.1(DIN)
$3N143328: C32.1 U3.5(PH0-OSC_IN) X1.3(2)
$3N143345: C34.1 U3.6(PH1-OSC_OUT) X1.1
$3N163906: LED16.2(K) R21.2
$3N173108: LED17.2(K) R22.2
$3N173421: C47.2 C48.2 L4.2 U5.1(IN) U5.3(EN)
$3N211870: C39.2 U3.30(VCAP_1)
$3N212247: R11.2 U3.60(BOOT0)
$3N212500: LED10.3(DOUT) LED11.1(DIN)
$3N212674: LED11.3(DOUT) LED12.1(DIN)
$3N212856: LED12.3(DOUT) LED13.1(DIN)
$3N213046: LED13.3(DOUT) LED14.1(DIN)
$3N213244: LED14.3(DOUT) LED15.1(DIN)

Not connected (* = marked no-connect by the designer): LED15 3(DOUT)*; SCREW1 1*; SCREW2 1*; SCREW3 1*; SCREW4 1*; SCREW5 1*; SCREW6 1*; SCREW7 1*; SCREW8 1*; SW1 1* 3*; SW2 1* 3*; U1 1(NC)*; U3 2(PC13-TAMPER-RTC) 3(PC14-OSC32_IN) 4(PC15-OSC32_OUT) 17(PA3) 20(PA4) 22(PA6) 55(PB3) 57(PB5); U4 19(NC)*; U5 4(NC)*; U6 3(OUT)* 5(PUSH)*; USB1 A8(SBU1)* B8(SBU2)*

## Notes on the sheet
- NEOPIXEL
- MICRO SD (SDIO 4BITS)
- KEY
- CAP
- nRST
- BLDC MOTOR DRIVER
- USB
- LDO 5V -> 3.3V
- MAGNETIC ENCODER
- SENSOR - AMBIENT LIGHT
